# EAGLE design RX8Edaughter (EAGLE 6.6.0)

## Sheet 1 of 2
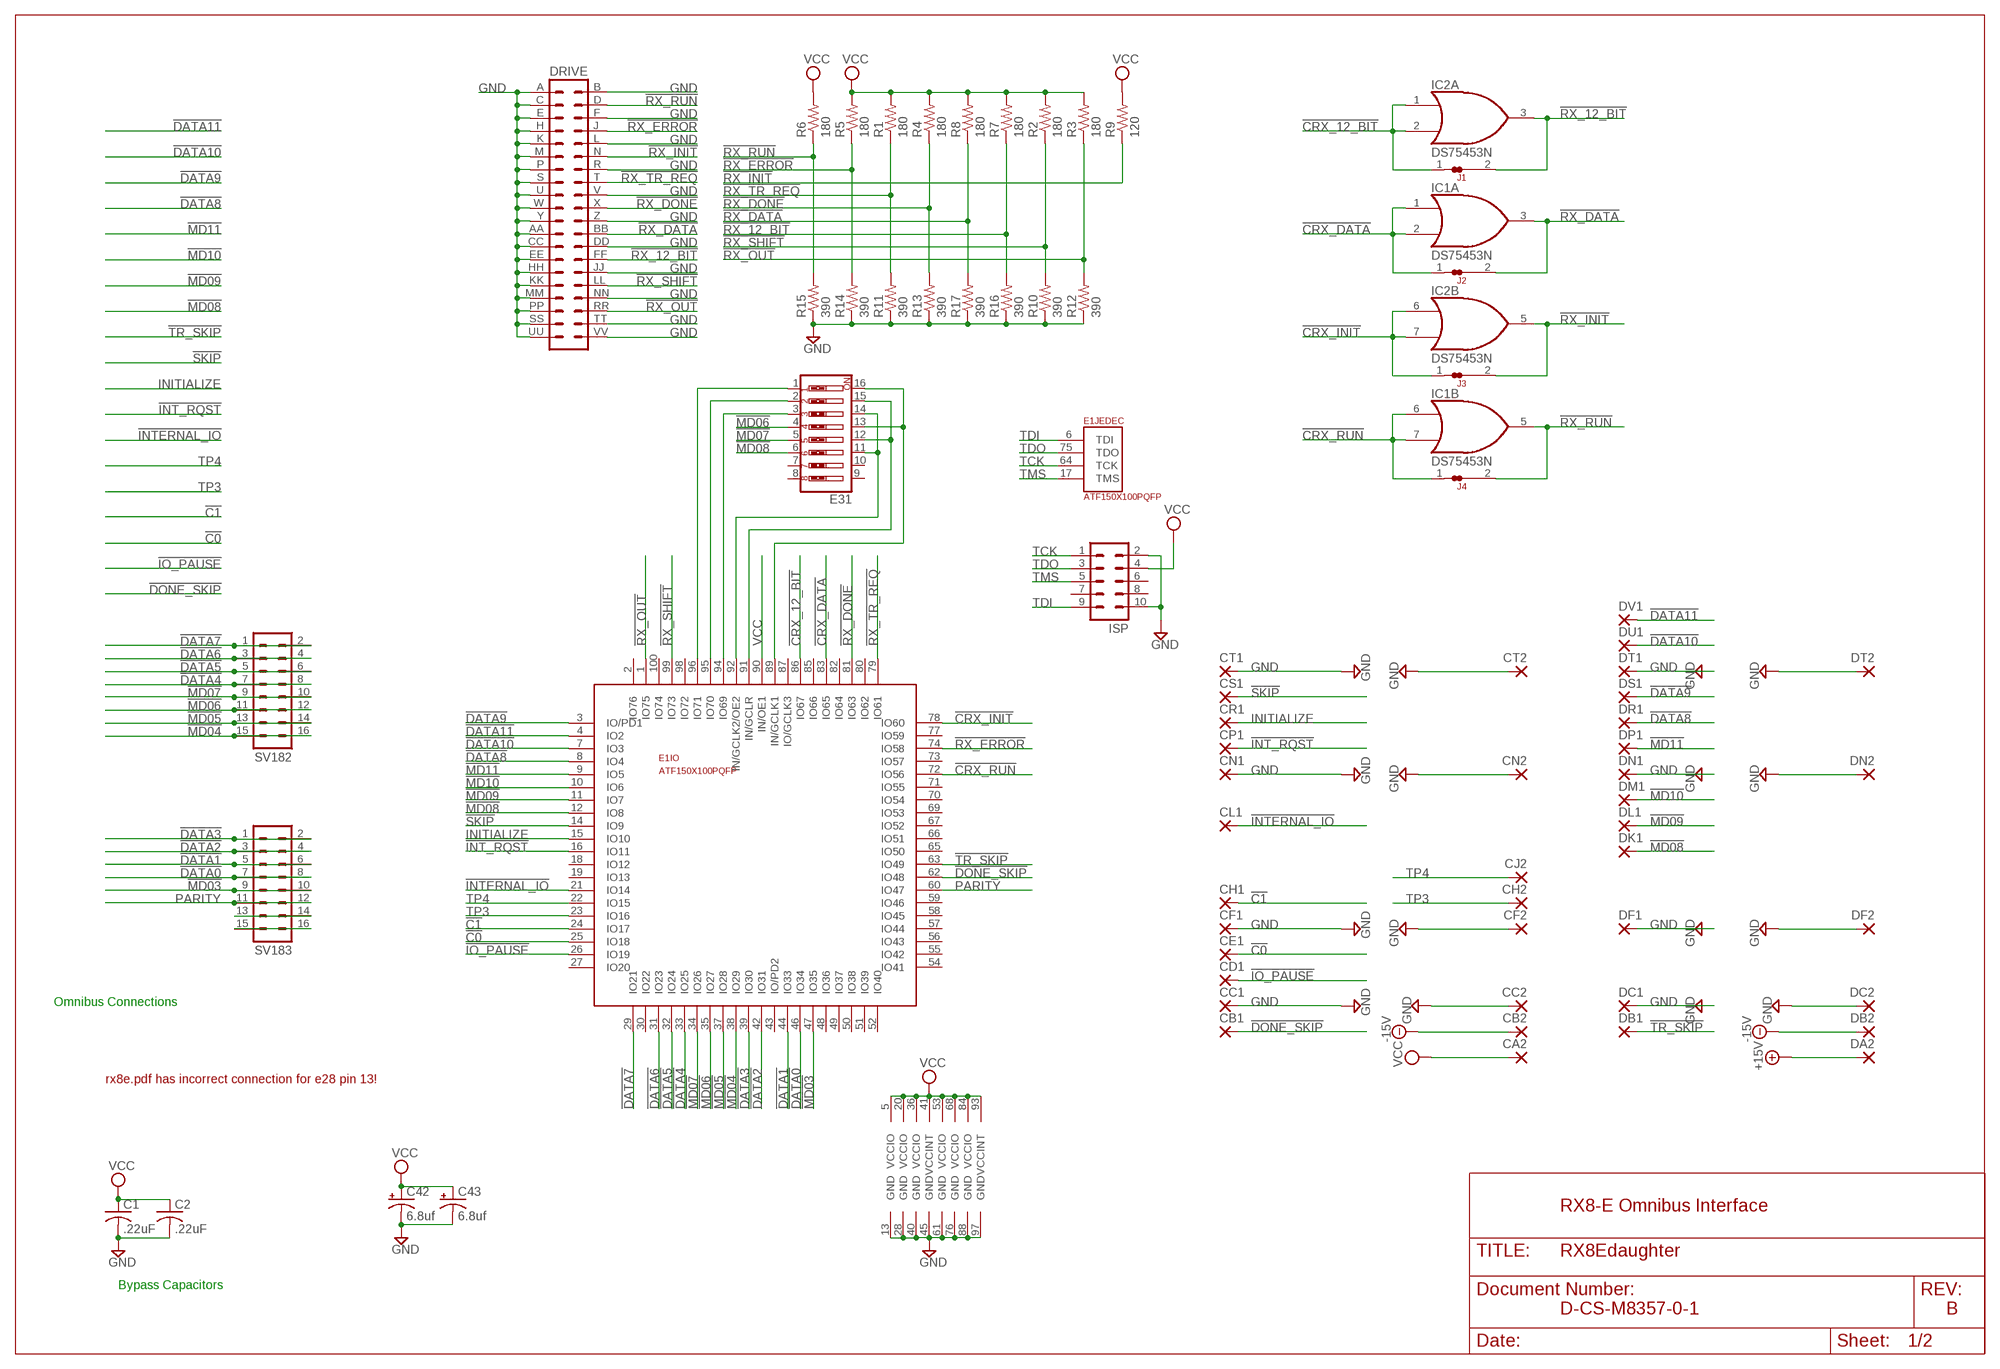
[diagram p0: schematic, sheet 1]

### Parts
C1  .22uF  C-US050-025X075  [C050-025X075]
C2  .22uF  C-US050-025X075  [C050-025X075]
C42  6.8uf  CPOL-USE22-6AXIAL  [E22-6]
C43  6.8uf  CPOL-USE22-6AXIAL  [E22-6]
CA2  1,6/0,9  [1,6/0,9]
CB1  1,6/0,9  [1,6/0,9]
CB2  1,6/0,9  [1,6/0,9]
CC1  1,6/0,9  [1,6/0,9]
CC2  1,6/0,9  [1,6/0,9]
CD1  1,6/0,9  [1,6/0,9]
CE1  1,6/0,9  [1,6/0,9]
CF1  1,6/0,9  [1,6/0,9]
CF2  1,6/0,9  [1,6/0,9]
CH1  1,6/0,9  [1,6/0,9]
CH2  1,6/0,9  [1,6/0,9]
CJ2  1,6/0,9  [1,6/0,9]
CL1  1,6/0,9  [1,6/0,9]
CN1  1,6/0,9  [1,6/0,9]
CN2  1,6/0,9  [1,6/0,9]
CP1  1,6/0,9  [1,6/0,9]
CR1  1,6/0,9  [1,6/0,9]
CS1  1,6/0,9  [1,6/0,9]
CT1  1,6/0,9  [1,6/0,9]
CT2  1,6/0,9  [1,6/0,9]
DA2  1,6/0,9  [1,6/0,9]
DB1  1,6/0,9  [1,6/0,9]
DB2  1,6/0,9  [1,6/0,9]
DC1  1,6/0,9  [1,6/0,9]
DC2  1,6/0,9  [1,6/0,9]
DF1  1,6/0,9  [1,6/0,9]
DF2  1,6/0,9  [1,6/0,9]
DK1  1,6/0,9  [1,6/0,9]
DL1  1,6/0,9  [1,6/0,9]
DM1  1,6/0,9  [1,6/0,9]
DN1  1,6/0,9  [1,6/0,9]
DN2  1,6/0,9  [1,6/0,9]
DP1  1,6/0,9  [1,6/0,9]
DR1  1,6/0,9  [1,6/0,9]
DRIVE  DEC40PINH  [DEC40PINH]
DS1  1,6/0,9  [1,6/0,9]
DT1  1,6/0,9  [1,6/0,9]
DT2  1,6/0,9  [1,6/0,9]
DU1  1,6/0,9  [1,6/0,9]
DV1  1,6/0,9  [1,6/0,9]
E1  ATF150X100PQFP  [PQFP-100]
E31  SW_DIP-8  [EDG-08]
IC1  DS75453N  [DIL08]
IC2  DS75453N  [DIL08]
ISP  ML10  [ML10]
J1  JUMPER-NC2  [NC2]
J2  JUMPER-NC2  [NC2]
J3  JUMPER-NC2  [NC2]
J4  JUMPER-NC2  [NC2]
R1  180  R-US_0207/10  [0207/10]
R2  180  R-US_0207/10  [0207/10]
R3  180  R-US_0207/10  [0207/10]
R4  180  R-US_0207/10  [0207/10]
R5  180  R-US_0207/10  [0207/10]
R6  180  R-US_0207/10  [0207/10]
R7  180  R-US_0207/10  [0207/10]
R8  180  R-US_0207/10  [0207/10]
R9  120  R-US_0207/10  [0207/10]
R10  390  R-US_0207/10  [0207/10]
R11  390  R-US_0207/10  [0207/10]
R12  390  R-US_0207/10  [0207/10]
R13  390  R-US_0207/10  [0207/10]
R14  390  R-US_0207/10  [0207/10]
R15  390  R-US_0207/10  [0207/10]
R16  390  R-US_0207/10  [0207/10]
R17  390  R-US_0207/10  [0207/10]
SV182  MA08-2  [MA08-2]
SV183  MA08-2  [MA08-2]

### Nets
!C0: CE1.1(P) E1.25(IO:IO18)
!C1: CH1.1(P) E1.24(IO:IO17)
!CRX_12_BIT: E1.86(IO:IO67) IC2.1(A:I0) IC2.2(A:I1) J1.1
!CRX_DATA: E1.83(IO:IO65) IC1.1(A:I0) IC1.2(A:I1) J2.1
!CRX_INIT: E1.78(IO:IO60) IC2.6(B:I0) IC2.7(B:I1) J3.1
!CRX_RUN: E1.72(IO:IO56) IC1.6(B:I0) IC1.7(B:I1) J4.1
!DATA0: E1.46(IO:IO34) SV183.7 SV183.8
!DATA1: E1.44(IO:IO33) SV183.5 SV183.6
!DATA2: E1.42(IO:IO31) SV183.3 SV183.4
!DATA3: E1.39(IO:IO30) SV183.1 SV183.2
!DATA4: E1.33(IO:IO25) SV182.7 SV182.8
!DATA5: E1.32(IO:IO24) SV182.5 SV182.6
!DATA6: E1.31(IO:IO23) SV182.3 SV182.4
!DATA7: E1.29(IO:IO21) SV182.1 SV182.2
!DATA8: DR1.1(P) E1.8(IO:IO4)
!DATA9: DS1.1(P) E1.3(IO:IO/PD1)
!DATA10: DU1.1(P) E1.7(IO:IO3)
!DATA11: DV1.1(P) E1.4(IO:IO2)
!DONE_SKIP: CB1.1(P) E1.62(IO:IO48)
!INT_RQST: CP1.1(P) E1.16(IO:IO11)
!INTERNAL_IO: CL1.1(P) E1.21(IO:IO14)
!IO_PAUSE: CD1.1(P) E1.26(IO:IO19)
!MD03: E1.47(IO:IO35) SV183.9 SV183.10
!MD04: E1.38(IO:IO29) SV182.15 SV182.16
!MD05: E1.37(IO:IO28) SV182.13 SV182.14
!MD06: E1.35(IO:IO27) E31.4 SV182.11 SV182.12
!MD07: E1.34(IO:IO26) E31.5 SV182.9 SV182.10
!MD08: DK1.1(P) E1.12(IO:IO8) E31.6
!MD09: DL1.1(P) E1.11(IO:IO7)
!MD10: DM1.1(P) E1.10(IO:IO6)
!MD11: DP1.1(P) E1.9(IO:IO5)
!RX_12_BIT: DRIVE.FF IC2.3(A:O) J1.2 R7.1 R16.2
!RX_DATA: DRIVE.BB IC1.3(A:O) J2.2 R8.1 R17.2
!RX_DONE: DRIVE.X E1.81(IO:IO63) R4.1 R13.2
!RX_ERROR: DRIVE.J E1.74(IO:IO58) R5.1 R14.2
!RX_INIT: DRIVE.N IC2.5(B:O) J3.2 R9.1
!RX_OUT: DRIVE.RR E1.1(IO:IO75) R3.1 R12.2
!RX_RUN: DRIVE.D IC1.5(B:O) J4.2 R6.1 R15.2
!RX_SHIFT: DRIVE.LL E1.99(IO:IO73) R2.1 R10.2
!RX_TR_REQ: DRIVE.T E1.79(IO:IO61) R1.1 R11.2
!SKIP: CS1.1(P) E1.14(IO:IO9)
!TR_SKIP: DB1.1(P) E1.63(IO:IO49)
+15V: DA2.1(P)
-15V [supply]: CB2.1(P) DB2.1(P)
GND [supply]: C1.2 C2.2 C42.- C43.- CC1.1(P) CC2.1(P) CF1.1(P) CF2.1(P) CN1.1(P) CN2.1(P) CT1.1(P) CT2.1(P) DC1.1(P) DC2.1(P) DF1.1(P) DF2.1(P) DN1.1(P) DN2.1(P) DRIVE.A DRIVE.AA DRIVE.B DRIVE.C DRIVE.CC DRIVE.DD DRIVE.E DRIVE.EE DRIVE.F DRIVE.H DRIVE.HH DRIVE.JJ DRIVE.K DRIVE.KK DRIVE.L DRIVE.M DRIVE.MM DRIVE.NN DRIVE.P DRIVE.PP DRIVE.R DRIVE.S DRIVE.SS DRIVE.TT DRIVE.U DRIVE.UU DRIVE.V DRIVE.VV DRIVE.W DRIVE.Y DRIVE.Z DT1.1(P) DT2.1(P) E1.13(GND) E1.28(GND) E1.40(GND) E1.45(GND) E1.61(GND) E1.76(GND) E1.88(GND) E1.97(GND) ISP.2 ISP.10 R10.1 R11.1 R12.1 R13.1 R14.1 R15.1 R16.1 R17.1 ; also sheet 2
INITIALIZE: CR1.1(P) E1.15(IO:IO10)
N$1: E1.94(IO:IO69) E31.3
N$18: E1.95(IO:IO70) E31.2
N$19: E1.96(IO:IO71) E31.1
N$20: E1.92(IO:IN/GCLK2/OE2) E31.11 E31.14
N$37: E1.91(IO:IN/GCLR) E31.12 E31.15
N$38: E1.89(IO:IN/GCLK1) E31.13 E31.16
N$45: SV183.13 SV183.14
N$828: SV183.15 SV183.16
PARITY: E1.60(IO:IO47) SV183.11 SV183.12
TCK: E1.64(JEDEC:TCK) ISP.1
TDI: E1.6(JEDEC:TDI) ISP.9
TDO: E1.75(JEDEC:TDO) ISP.3
TMS: E1.17(JEDEC:TMS) ISP.5
TP3: CH2.1(P) E1.23(IO:IO16)
TP4: CJ2.1(P) E1.22(IO:IO15)
VCC [supply]: C1.1 C2.1 C42.+ C43.+ CA2.1(P) E1.5(VCCIO) E1.20(VCCIO) E1.36(VCCIO) E1.41(VCCINT) E1.53(VCCIO) E1.68(VCCIO) E1.84(VCCIO) E1.90(IO:IN/OE1) E1.93(VCCINT) ISP.4 R1.2 R2.2 R3.2 R4.2 R5.2 R6.2 R7.2 R8.2 R9.2 ; also sheet 2
Unconnected: E1.2(IO:IO76) E1.18(IO:IO12) E1.19(IO:IO13) E1.27(IO:IO20) E1.30(IO:IO22) E1.43(IO:IO/PD2) E1.48(IO:IO36) E1.49(IO:IO37) E1.50(IO:IO38) E1.51(IO:IO39) E1.52(IO:IO40) E1.54(IO:IO41) E1.55(IO:IO42) E1.56(IO:IO43) E1.57(IO:IO44) E1.58(IO:IO45) E1.59(IO:IO46) E1.65(IO:IO50) E1.66(IO:IO51) E1.67(IO:IO52) E1.69(IO:IO53) E1.70(IO:IO54) E1.71(IO:IO55) E1.73(IO:IO57) E1.77(IO:IO59) E1.80(IO:IO62) E1.82(IO:IO64) E1.85(IO:IO66) E1.87(IO:IO/GCLK3) E1.98(IO:IO72) E1.100(IO:IO74) E31.7 E31.8 E31.9 E31.10 ISP.6 ISP.7 ISP.8

### Notes on the sheet
- Omnibus Connections
- rx8e.pdf has incorrect connection for e28 pin 13!
- RX8-E Omnibus Interface
- Bypass Capacitors
- D-CS-M8357-0-1 | B

## Sheet 2 of 2
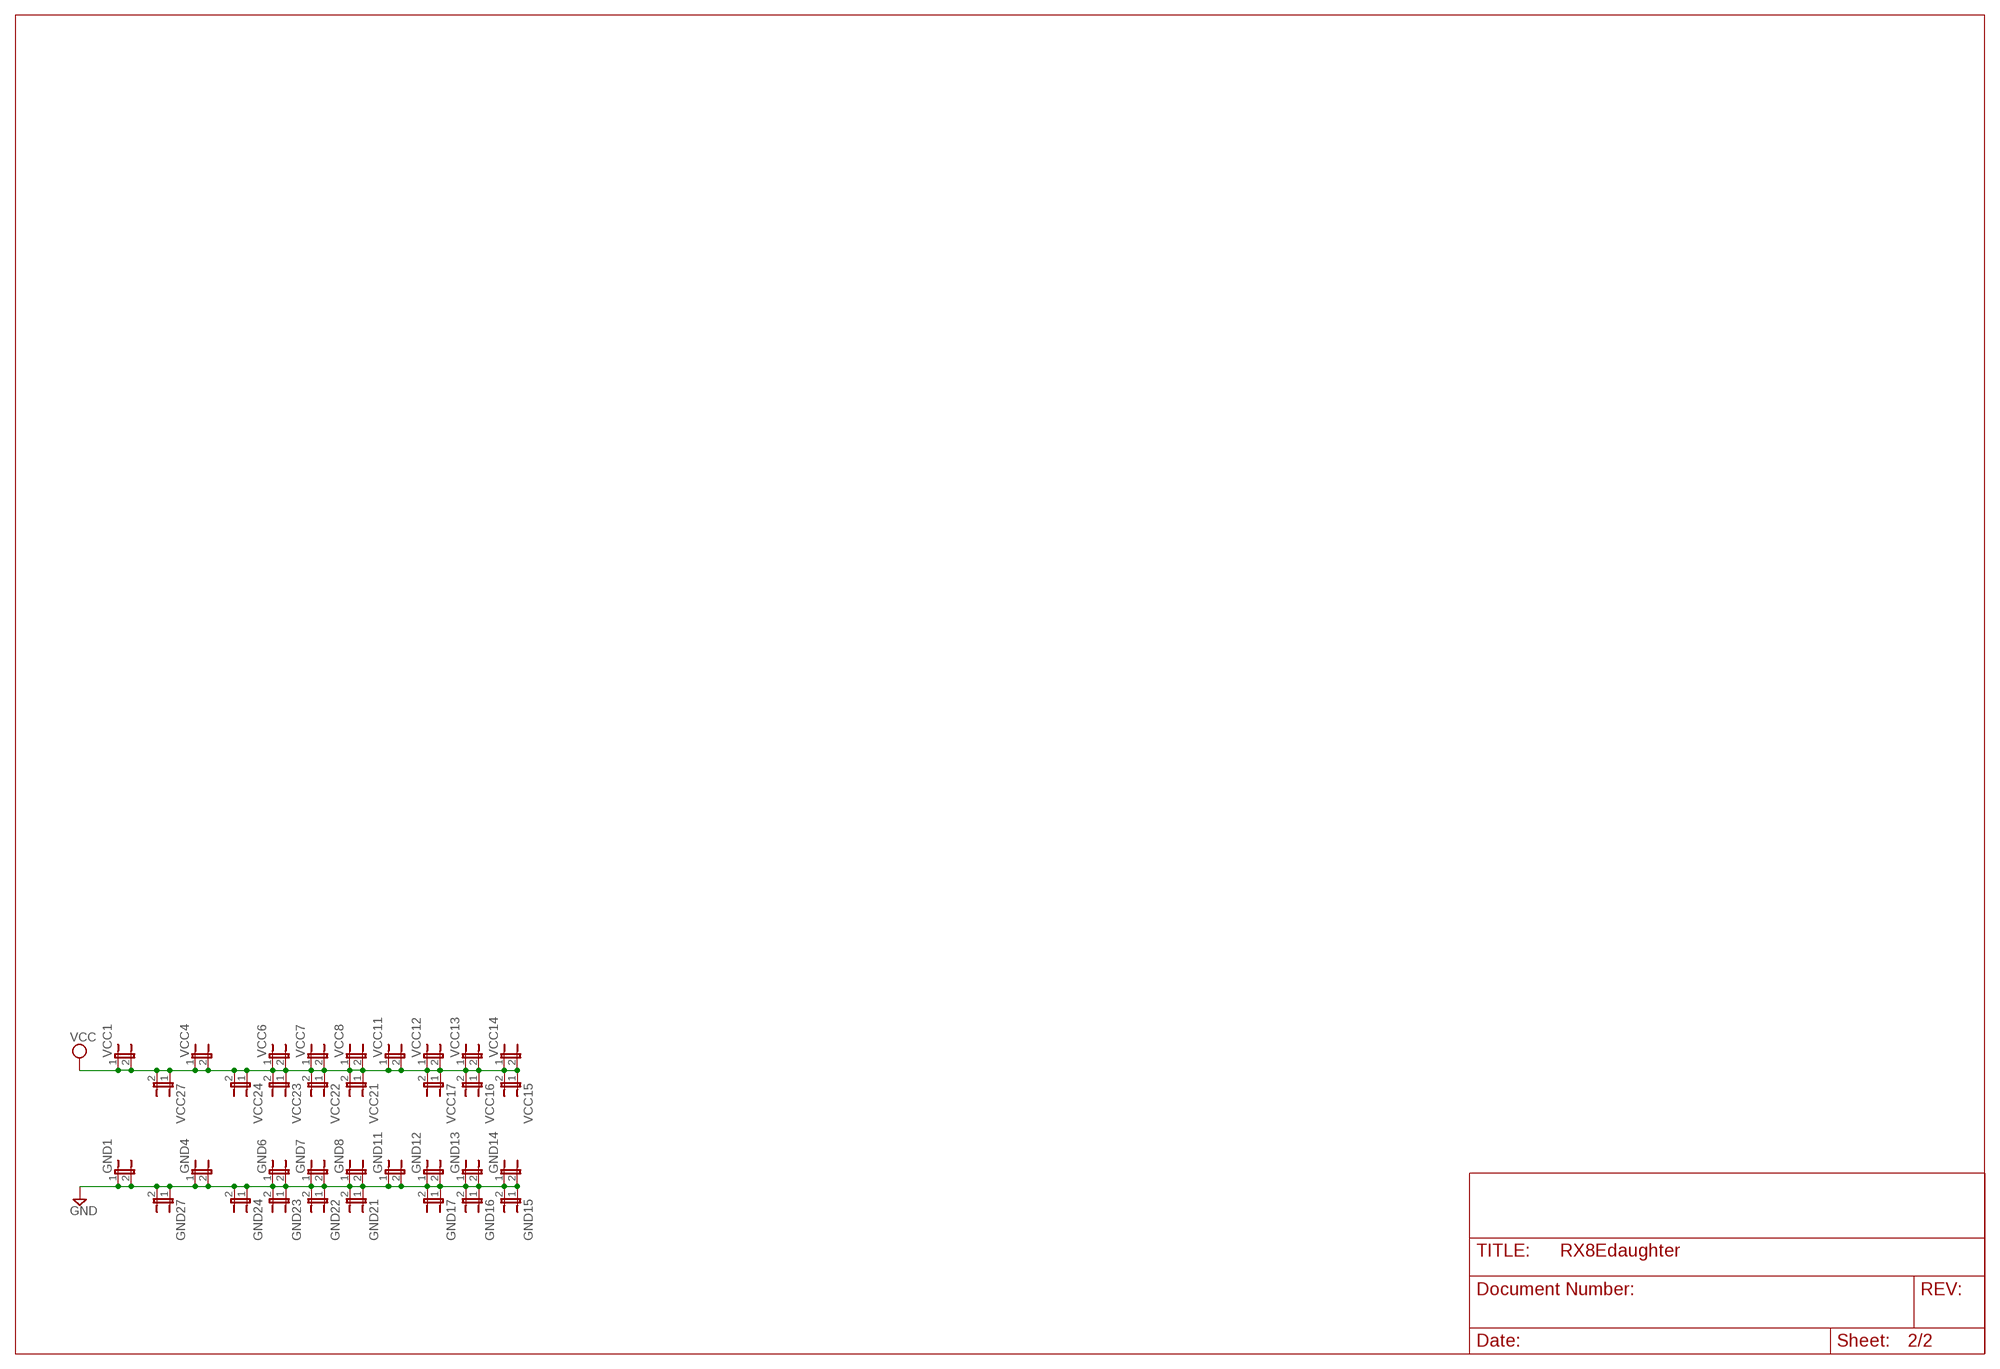
[diagram p1: schematic, sheet 2]

### Parts
GND1  JP1E  [JP1]
GND4  JP1E  [JP1]
GND6  JP1E  [JP1]
GND7  JP1E  [JP1]
GND8  JP1E  [JP1]
GND11  JP1E  [JP1]
GND12  JP1E  [JP1]
GND13  JP1E  [JP1]
GND14  JP1E  [JP1]
GND15  JP1E  [JP1]
GND16  JP1E  [JP1]
GND17  JP1E  [JP1]
GND21  JP1E  [JP1]
GND22  JP1E  [JP1]
GND23  JP1E  [JP1]
GND24  JP1E  [JP1]
GND27  JP1E  [JP1]
VCC1  JP1E  [JP1]
VCC4  JP1E  [JP1]
VCC6  JP1E  [JP1]
VCC7  JP1E  [JP1]
VCC8  JP1E  [JP1]
VCC11  JP1E  [JP1]
VCC12  JP1E  [JP1]
VCC13  JP1E  [JP1]
VCC14  JP1E  [JP1]
VCC15  JP1E  [JP1]
VCC16  JP1E  [JP1]
VCC17  JP1E  [JP1]
VCC21  JP1E  [JP1]
VCC22  JP1E  [JP1]
VCC23  JP1E  [JP1]
VCC24  JP1E  [JP1]
VCC27  JP1E  [JP1]

### Nets
GND [supply]: GND1.1 GND1.2 GND4.1 GND4.2 GND6.1 GND6.2 GND7.1 GND7.2 GND8.1 GND8.2 GND11.1 GND11.2 GND12.1 GND12.2 GND13.1 GND13.2 GND14.1 GND14.2 GND15.1 GND15.2 GND16.1 GND16.2 GND17.1 GND17.2 GND21.1 GND21.2 GND22.1 GND22.2 GND23.1 GND23.2 GND24.1 GND24.2 GND27.1 GND27.2 ; also sheet 1
VCC [supply]: VCC1.1 VCC1.2 VCC4.1 VCC4.2 VCC6.1 VCC6.2 VCC7.1 VCC7.2 VCC8.1 VCC8.2 VCC11.1 VCC11.2 VCC12.1 VCC12.2 VCC13.1 VCC13.2 VCC14.1 VCC14.2 VCC15.1 VCC15.2 VCC16.1 VCC16.2 VCC17.1 VCC17.2 VCC21.1 VCC21.2 VCC22.1 VCC22.2 VCC23.1 VCC23.2 VCC24.1 VCC24.2 VCC27.1 VCC27.2 ; also sheet 1

## Power pins joined to a net without a drawn wire
GND: IC1.4(P:GND) IC2.4(P:GND)
VCC: IC1.8(P:VCC) IC2.8(P:VCC)

## Library data of the parts
C1 C2 = rcl:C-US: CAPACITOR, American symbol
C42 C43 = rcl:CPOL-US: POLARIZED CAPACITOR, American symbol
CA2 CB1 CB2 CC1 CC2 CD1 CE1 CF1 CF2 CH1 CH2 CJ2 CL1 CN1 CN2 CP1 CR1 CS1 CT1 CT2 DA2 DB1 DB2 DC1 DC2 DF1 DF2 DK1 DL1 DM1 DN1 DN2 DP1 DR1 DS1 DT1 DT2 DU1 DV1 = wirepad:1,6/0,9: THROUGH-HOLE PAD
DRIVE = dec-con:DEC40PIN: PIN HEADER
E1 = atmel-cpld:ATF150X100: ATF150x in 100 pin package.
E31 = special:SW_DIP-8: DIP SWITCH
GND1 GND4 GND6-GND8 GND11-GND17 GND21-GND24 GND27 VCC1 VCC4 VCC6-VCC8 VCC11-VCC17 VCC21-VCC24 VCC27 = jumper:JP1E: JUMPER
IC1 IC2 = dec-con:DS75453: Quad 2-input OR gate, open collector output
ISP = con-harting-ml:ML10: HARTING; OC_FARNELL: unknown; OC_NEWARK: unknown
J1-J4 = dec-con:JUMPER: Normally closed SMD Jumper (Generates a DRC error.)
R1-R17 = rcl:R-US_: RESISTOR, American symbol
SV182 SV183 = con-lstb:MA08-2: PIN HEADER; OC_FARNELL: unknown; OC_NEWARK: unknown

## Board
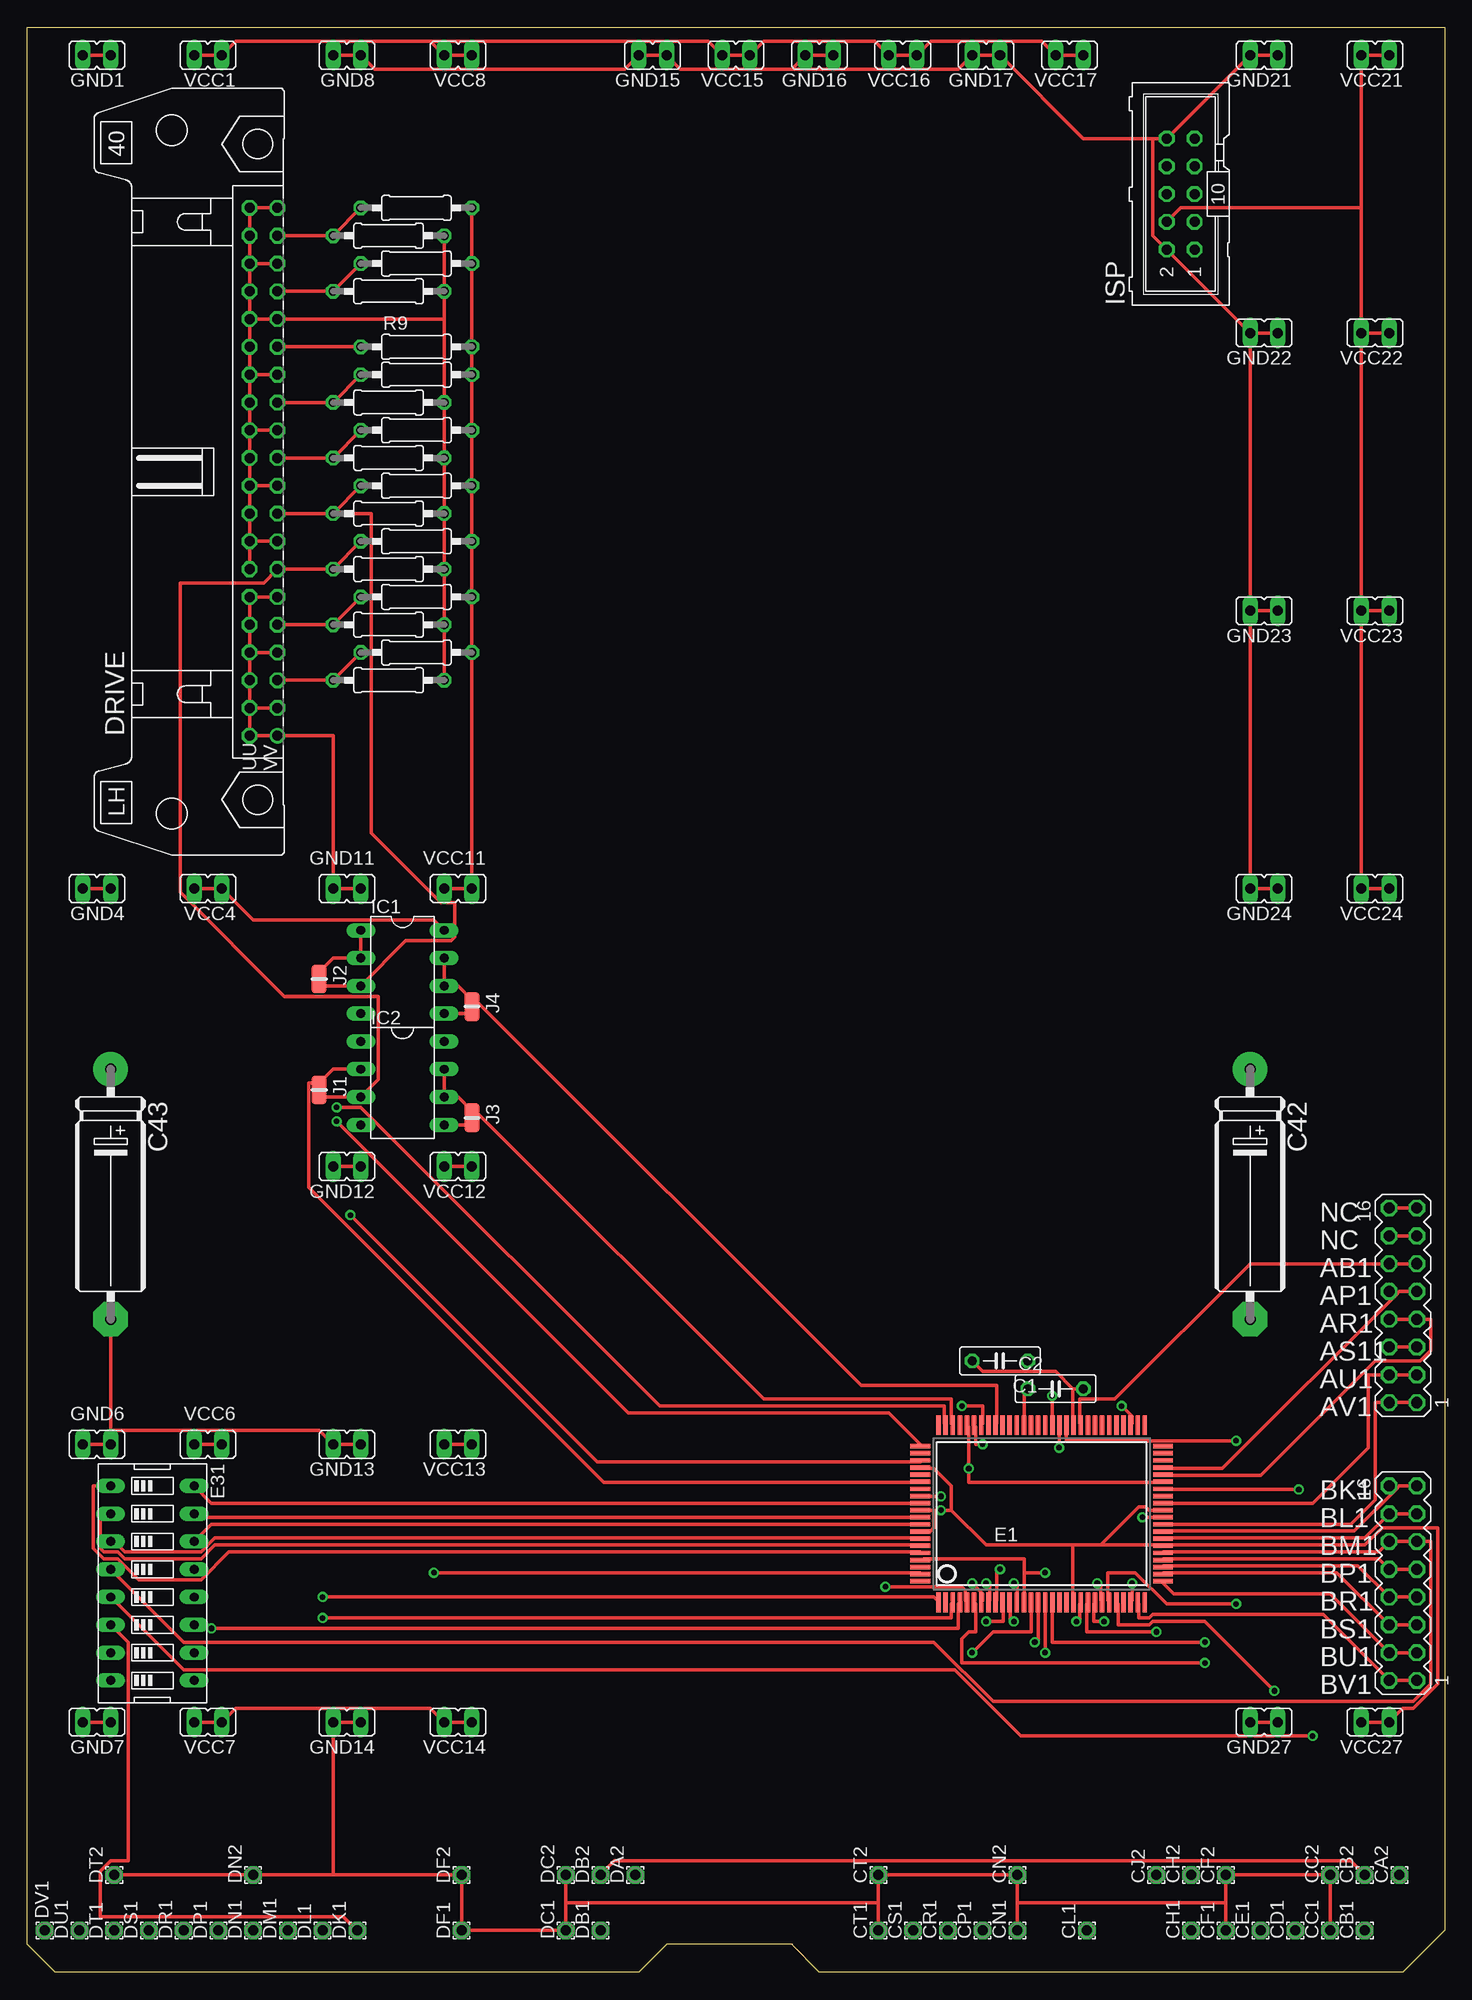
[diagram p2: board, top side]
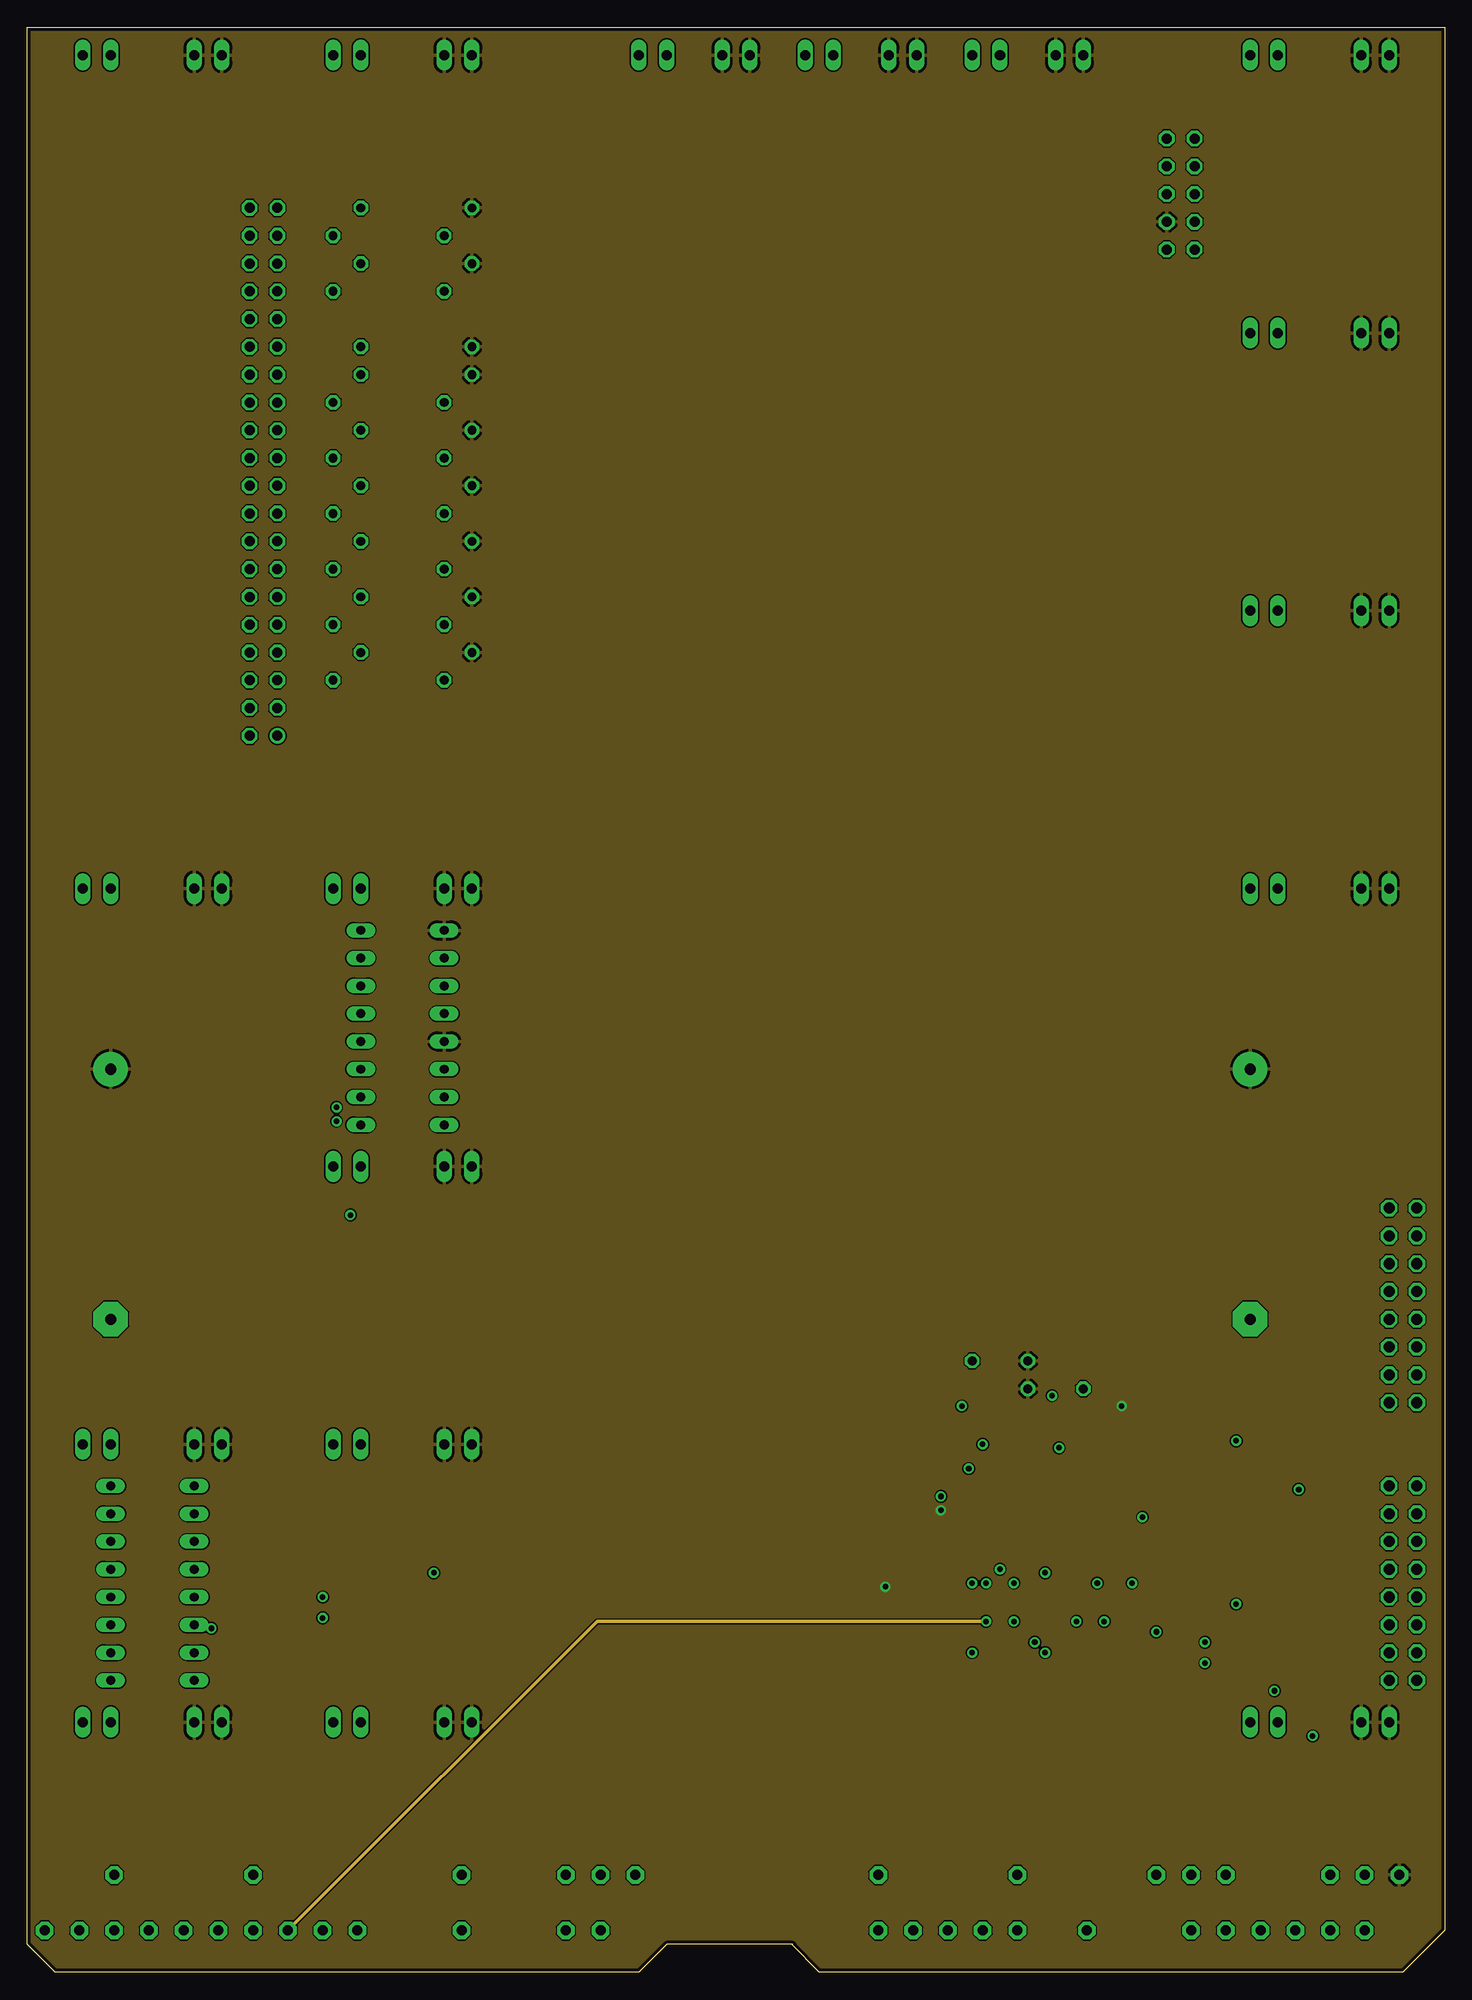
[diagram p3: board, inner layer VCC$]
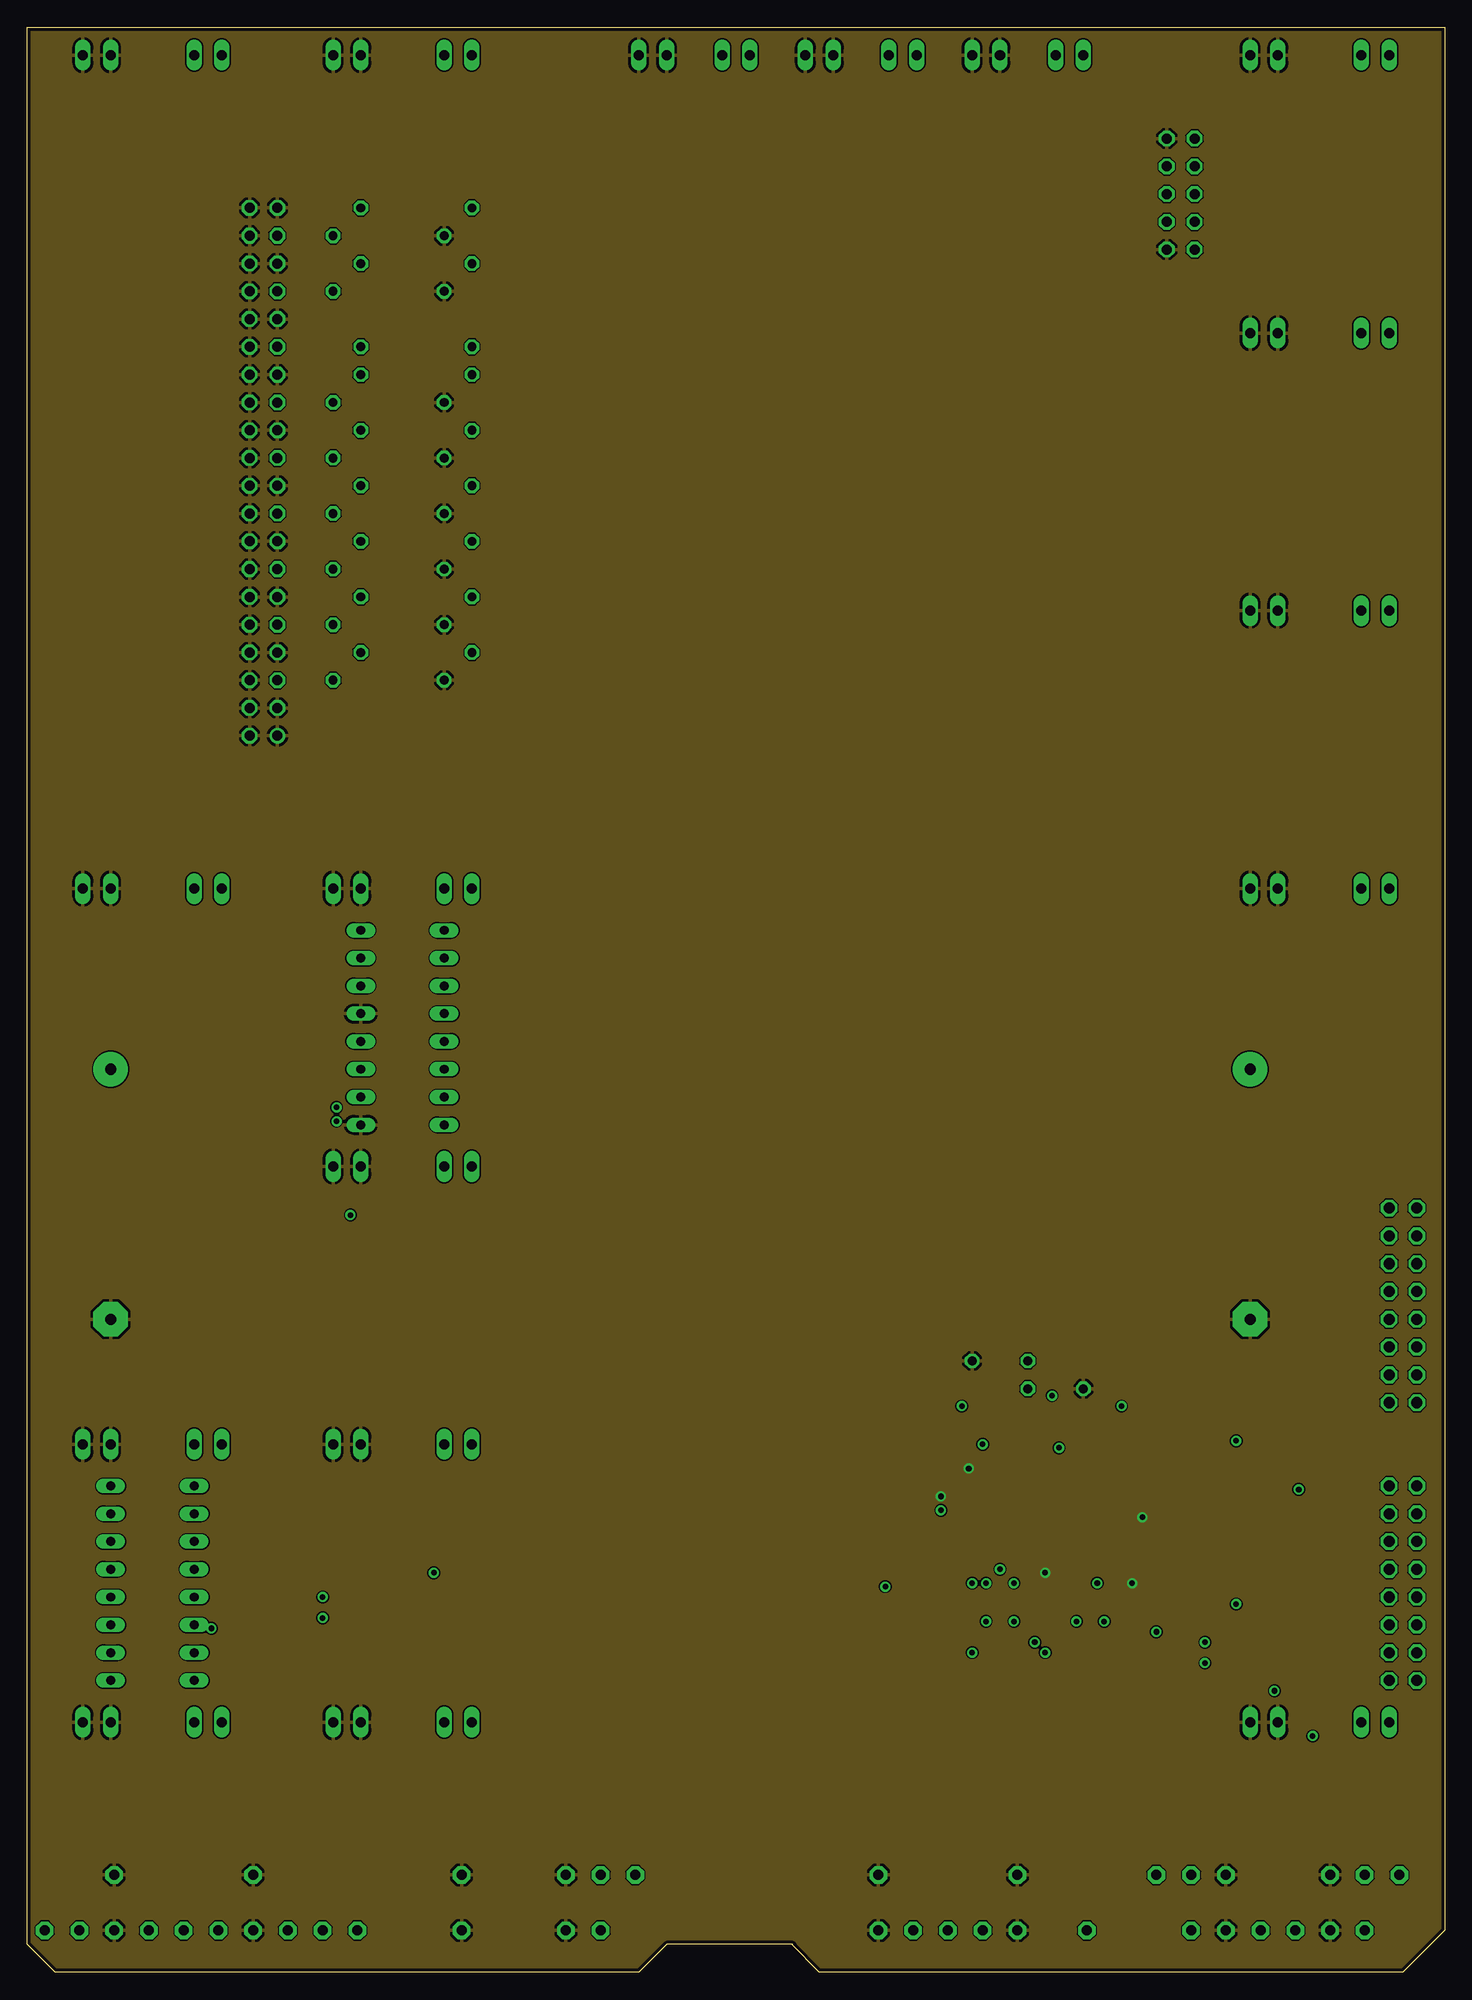
[diagram p4: board, inner layer GND$]
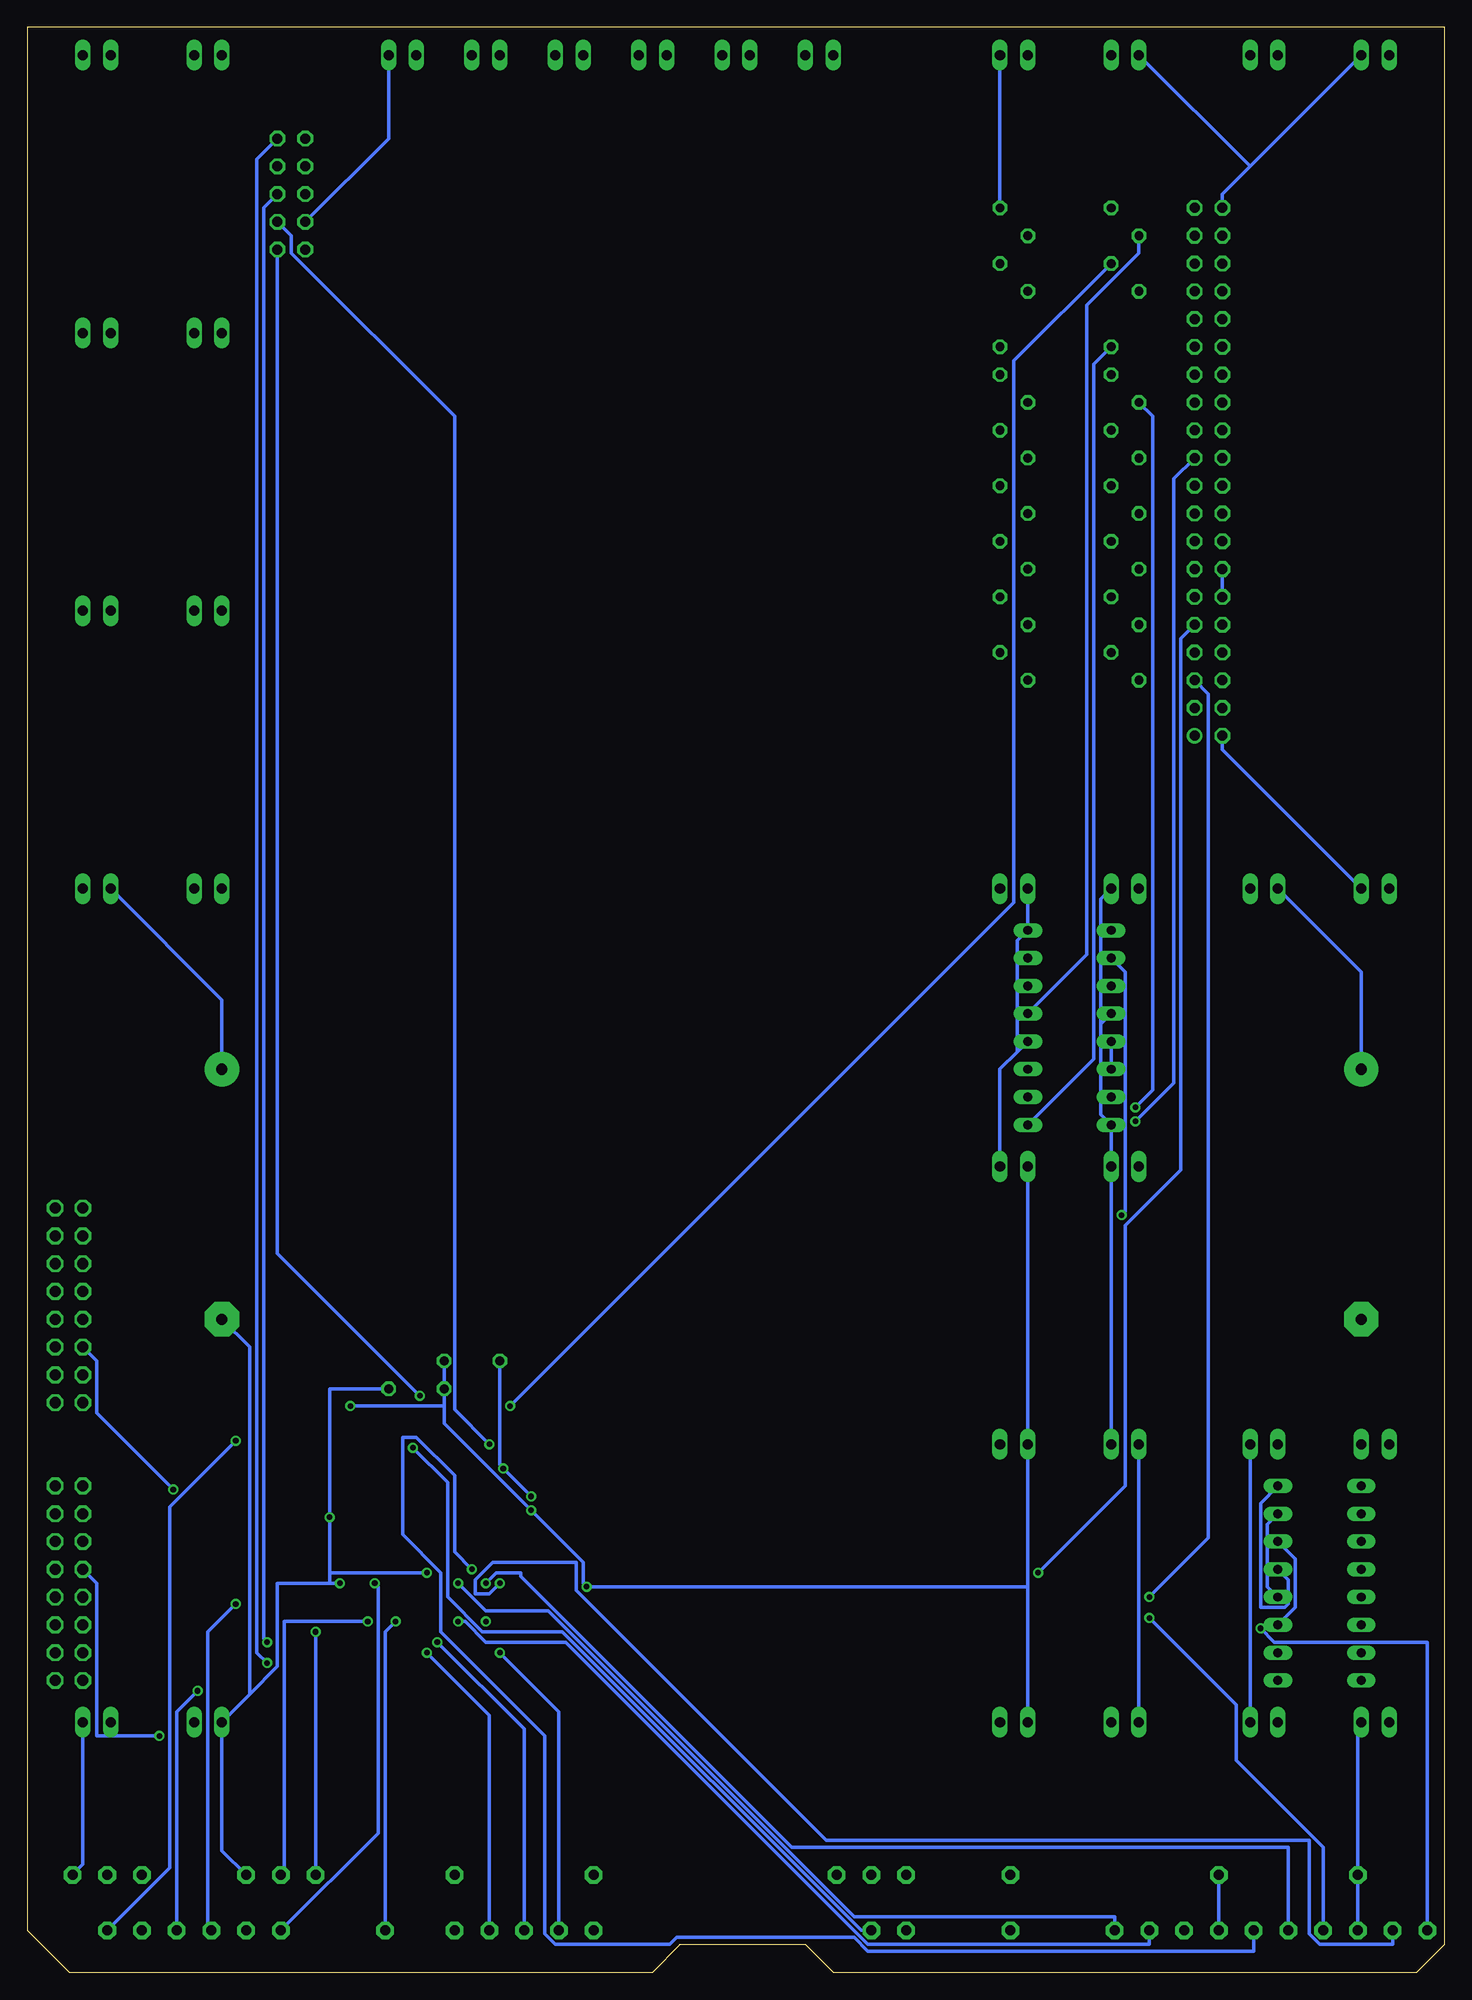
[diagram p5: board, bottom side, seen from below]

Size 129.54 x 177.8 mm. Coordinates in mm from the lower left corner, seen from the top.
Outline: 69.98,2.54 69.85,2.54
Outline: 69.85,2.54 72.39,0 125.73,0 129.54,3.81 129.54,177.8 0,177.8 0,2.54 2.54,0 55.88,0 58.42,2.54 69.85,2.54
Copper layers (1+2+3+16): Top 0.035mm / dielectric 1.5mm / VCC$ 0.035mm / dielectric 0.15mm / GND$ 0.035mm / dielectric 0.2mm / Bottom 0.035mm
Design rules "pld *": minimum track width 12mil, minimum drill 20mil, track to track 5mil, track to pad 5mil, pad to pad 5mil, via to via 10mil, smd to smd 5mil, copper to edge 13mil, drill to drill 10mil, minimum pad ring 10mil, minimum via ring 8mil, stop-mask expansion 0mil, vias tented up to drill 0mil, thermal gap 10mil

### Footprints (pad centres in the part's own frame; a part is rotated, then mirrored left to right if it is on the bottom)
C050-025X075 = drill 0.813 octagon: 1 -2.54,0; 2 2.54,0
E22-6 = drill 1.016 pad 3.15: + -11.43,0 | drill 1.016 pad 3.15 octagon: - 11.43,0
1,6/0,9 = drill 0.914 pad 1.6 octagon: 1 0,0
DEC40PINH = drill 0.914 octagon: A 24.13,1.27; AA -3.81,1.27; B 24.13,-1.27; BB -3.81,-1.27; C 21.59,1.27; CC -6.35,1.27; D 21.59,-1.27; DD -6.35,-1.27; E 19.05,1.27; EE -8.89,1.27; F 19.05,-1.27; FF -8.89,-1.27; H 16.51,1.27; HH -11.43,1.27; J 16.51,-1.27; JJ -11.43,-1.27; K 13.97,1.27; KK -13.97,1.27; L 13.97,-1.27; LL -13.97,-1.27; M 11.43,1.27; MM -16.51,1.27; N 11.43,-1.27; NN -16.51,-1.27; P 8.89,1.27; PP -19.05,1.27; R 8.89,-1.27; RR -19.05,-1.27; S 6.35,1.27; SS -21.59,1.27; T 6.35,-1.27; TT -21.59,-1.27; U 3.81,1.27; UU -24.13,1.27; V 3.81,-1.27; W 1.27,1.27; X 1.27,-1.27; Y -1.27,1.27; Z -1.27,-1.27 | drill 0.914: VV -24.13,-1.27
PQFP-100 = smd 0.4 x 1.8: 1 -9.425,-8.1; 2 -8.775,-8.1; 3 -8.125,-8.1; 4 -7.475,-8.1; 5 -6.825,-8.1; 6 -6.175,-8.1; 7 -5.525,-8.1; 8 -4.875,-8.1; 9 -4.225,-8.1; 10 -3.575,-8.1; 11 -2.925,-8.1; 12 -2.275,-8.1; 13 -1.625,-8.1; 14 -0.975,-8.1; 15 -0.325,-8.1; 16 0.325,-8.1; 17 0.975,-8.1; 18 1.625,-8.1; 19 2.275,-8.1; 20 2.925,-8.1; 21 3.575,-8.1; 22 4.225,-8.1; 23 4.875,-8.1; 24 5.525,-8.1; 25 6.175,-8.1; 26 6.825,-8.1; 27 7.475,-8.1; 28 8.125,-8.1; 29 8.775,-8.1; 30 9.425,-8.1; 51 9.425,8.1; 52 8.775,8.1; 53 8.125,8.1; 54 7.475,8.1; 55 6.825,8.1; 56 6.175,8.1; 57 5.525,8.1; 58 4.875,8.1; 59 4.225,8.1; 60 3.575,8.1; 61 2.925,8.1; 62 2.275,8.1; 63 1.625,8.1; 64 0.975,8.1; 65 0.325,8.1; 66 -0.325,8.1; 67 -0.975,8.1; 68 -1.625,8.1; 69 -2.275,8.1; 70 -2.925,8.1; 71 -3.575,8.1; 72 -4.225,8.1; 73 -4.875,8.1; 74 -5.525,8.1; 75 -6.175,8.1; 76 -6.825,8.1; 77 -7.475,8.1; 78 -8.125,8.1; 79 -8.775,8.1; 80 -9.425,8.1 | smd 1.8 x 0.4: 31 11.1,-6.175; 32 11.1,-5.525; 33 11.1,-4.875; 34 11.1,-4.225; 35 11.1,-3.575; 36 11.1,-2.925; 37 11.1,-2.275; 38 11.1,-1.625; 39 11.1,-0.975; 40 11.1,-0.325; 41 11.1,0.325; 42 11.1,0.975; 43 11.1,1.625; 44 11.1,2.275; 45 11.1,2.925; 46 11.1,3.575; 47 11.1,4.225; 48 11.1,4.875; 49 11.1,5.525; 50 11.1,6.175; 81 -11.1,6.175; 82 -11.1,5.525; 83 -11.1,4.875; 84 -11.1,4.225; 85 -11.1,3.575; 86 -11.1,2.925; 87 -11.1,2.275; 88 -11.1,1.625; 89 -11.1,0.975; 90 -11.1,0.325; 91 -11.1,-0.325; 92 -11.1,-0.975; 93 -11.1,-1.625; 94 -11.1,-2.275; 95 -11.1,-2.925; 96 -11.1,-3.575; 97 -11.1,-4.225; 98 -11.1,-4.875; 99 -11.1,-5.525; 100 -11.1,-6.175
EDG-08 = drill 0.813 long: 1 -8.89,-3.81; 2 -6.35,-3.81; 3 -3.81,-3.81; 4 -1.27,-3.81; 5 1.27,-3.81; 6 3.81,-3.81; 7 6.35,-3.81; 8 8.89,-3.81; 9 8.89,3.81; 10 6.35,3.81; 11 3.81,3.81; 12 1.27,3.81; 13 -1.27,3.81; 14 -3.81,3.81; 15 -6.35,3.81; 16 -8.89,3.81
JP1 = drill 0.914 long: 1 0,-1.27; 2 0,1.27
DIL08 = drill 0.813 long: 1 -3.81,-3.81; 2 -1.27,-3.81; 3 1.27,-3.81; 4 3.81,-3.81; 5 3.81,3.81; 6 1.27,3.81; 7 -1.27,3.81; 8 -3.81,3.81
ML10 = drill 0.914 octagon: 1 -5.08,-1.27; 2 -5.08,1.27; 3 -2.54,-1.27; 4 -2.54,1.27; 5 0,-1.27; 6 0,1.27; 7 2.54,-1.27; 8 2.54,1.27; 9 5.08,-1.27; 10 5.08,1.27
NC2 = smd 1.346 x 1.346: 1 -0.635,0; 2 0.635,0
0207/10 = drill 0.813 octagon: 1 -5.08,0; 2 5.08,0
MA08-2 = drill 1.016 octagon: 1 -8.89,-1.27; 2 -8.89,1.27; 3 -6.35,-1.27; 4 -6.35,1.27; 5 -3.81,-1.27; 6 -3.81,1.27; 7 -1.27,-1.27; 8 -1.27,1.27; 9 1.27,-1.27; 10 1.27,1.27; 11 3.81,-1.27; 12 3.81,1.27; 13 6.35,-1.27; 14 6.35,1.27; 15 8.89,-1.27; 16 8.89,1.27

### Placement (x,y rotation side)
C1  88.9,55.88 180 top
C2  93.98,53.34 0 top
C42  111.76,71.12 270 top
C43  7.62,71.12 270 top
CA2  125.41,8.89 90 top
CB1  122.24,3.81 90 top
CB2  122.24,8.89 90 top
CC1  119.06,3.81 90 top
CC2  119.06,8.89 90 top
CD1  115.89,3.81 90 top
CE1  112.71,3.81 90 top
CF1  109.54,3.81 90 top
CF2  109.54,8.89 90 top
CH1  106.36,3.81 90 top
CH2  106.36,8.89 90 top
CJ2  103.19,8.89 90 top
CL1  96.84,3.81 90 top
CN1  90.49,3.81 90 top
CN2  90.49,8.89 90 top
CP1  87.31,3.81 90 top
CR1  84.14,3.81 90 top
CS1  80.96,3.81 90 top
CT1  77.79,3.81 90 top
CT2  77.79,8.89 90 top
DA2  55.56,8.89 90 top
DB1  52.39,3.81 90 top
DB2  52.39,8.89 90 top
DC1  49.21,3.81 90 top
DC2  49.21,8.89 90 top
DF1  39.69,3.81 90 top
DF2  39.69,8.89 90 top
DK1  30.16,3.81 90 top
DL1  26.99,3.81 90 top
DM1  23.81,3.81 90 top
DN1  20.64,3.81 90 top
DN2  20.64,8.89 90 top
DP1  17.46,3.81 90 top
DR1  14.29,3.81 90 top
DRIVE  21.59,137.16 90 top
DS1  11.11,3.81 90 top
DT1  7.94,3.81 90 top
DT2  7.94,8.89 90 top
DU1  4.76,3.81 90 top
DV1  1.59,3.81 90 top
E1  92.71,41.91 0 top
E31  11.43,35.56 270 top
GND1  6.35,175.26 90 top
GND4  6.35,99.06 90 top
GND6  6.35,48.26 90 top
GND7  6.35,22.86 90 top
GND8  29.21,175.26 90 top
GND11  29.21,99.06 90 top
GND12  29.21,73.66 90 top
GND13  29.21,48.26 90 top
GND14  29.21,22.86 90 top
GND15  57.15,175.26 90 top
GND16  72.39,175.26 90 top
GND17  87.63,175.26 90 top
GND21  113.03,175.26 90 top
GND22  113.03,149.86 90 top
GND23  113.03,124.46 90 top
GND24  113.03,99.06 90 top
GND27  113.03,22.86 90 top
IC1  34.29,91.44 270 top
IC2  34.29,81.28 270 top
ISP  105.41,162.56 90 top
J1  26.67,80.64 270 top
J2  26.67,90.81 270 top
J3  40.64,78.11 270 top
J4  40.64,88.27 270 top
R1  35.56,146.05 0 top
R2  35.56,125.73 0 top
R3  35.56,120.65 0 top
R4  35.56,140.97 0 top
R5  35.56,156.21 0 top
R6  35.56,161.29 0 top
R7  35.56,130.81 0 top
R8  35.56,135.89 0 top
R9  35.56,148.59 0 top
R10  33.02,123.19 180 top
R11  33.02,143.51 180 top
R12  33.02,118.11 180 top
R13  33.02,138.43 180 top
R14  33.02,153.67 180 top
R15  33.02,158.75 180 top
R16  33.02,128.27 180 top
R17  33.02,133.35 180 top
SV182  125.73,35.56 90 top
SV183  125.73,60.96 90 top
VCC1  16.51,175.26 90 top
VCC4  16.51,99.06 90 top
VCC6  16.51,48.26 90 top
VCC7  16.51,22.86 90 top
VCC8  39.37,175.26 90 top
VCC11  39.37,99.06 90 top
VCC12  39.37,73.66 90 top
VCC13  39.37,48.26 90 top
VCC14  39.37,22.86 90 top
VCC15  64.77,175.26 90 top
VCC16  80.01,175.26 90 top
VCC17  95.25,175.26 90 top
VCC21  123.19,175.26 90 top
VCC22  123.19,149.86 90 top
VCC23  123.19,124.46 90 top
VCC24  123.19,99.06 90 top
VCC27  123.19,22.86 90 top

### Tracks (layer width: path | path; a pad name or v marks a point on that pad's centre or on a via)
!C0  (via drill 0.51)
  Top 0.305: v110.49,33.66 104.14,33.66 101.28,36.51 98.74,36.51 98.74,33.97 E1.25
  Bottom 0.305: v110.49,33.66 113.03,31.11 113.03,4.13 CE1.1
!C1  (via drill 0.51)
  Top 0.305: v97.79,35.56 98.11,35.56 98.11,33.97 E1.24
  Bottom 0.305: v97.79,35.56 97.47,35.24 97.47,12.7 CH1.1
!CRX_12_BIT
  Top 0.305: IC2.2 27.94,82.55 J1.1 25.72,81.28 25.72,71.75 52.7,44.77 81.6,44.77 E1.86
  Bottom 0.305: IC2.2 IC2.1
!CRX_DATA  (via drill 0.51)
  Top 0.305: J2.1 27.94,92.71 IC1.2 IC1.1 | v29.53,69.22 52.07,46.67 81.6,46.67 E1.83
  Bottom 0.305: v29.53,69.22 29.21,69.53 29.21,91.44 IC1.2
!CRX_INIT
  Top 0.305: E1.78 84.45,50.16 84.45,52.39 67.31,52.39 40.96,78.74 J3.1 39.37,80.01 IC2.6 IC2.7
!CRX_RUN
  Top 0.305: E1.72 88.58,50.16 88.58,53.66 76.2,53.66 40.96,88.9 J4.1 39.37,90.17 IC1.6 IC1.7
!DATA0
  Top 0.305: E1.46 103.82,45.4 112.71,45.4 123.19,55.88 127.32,55.88 128.27,56.83 128.27,59.69 SV183.7 SV183.8
!DATA1  (via drill 0.51)
  Top 0.305: v116.2,44.13 103.82,44.13 E1.44 | SV183.6 SV183.5
  Bottom 0.305: v116.2,44.13 123.19,51.12 123.19,55.88 SV183.6
!DATA2
  Top 0.305: E1.42 103.82,42.86 117.47,42.86 122.56,47.94 122.56,54.61 SV183.4 SV183.3
!DATA3
  Top 0.305: E1.39 103.82,40.96 120.97,40.96 123.19,43.18 123.19,52.07 SV183.2 SV183.1
!DATA4
  Top 0.305: E1.33 103.82,37.15 121.6,37.15 SV182.8 SV182.7
!DATA5
  Top 0.305: E1.32 103.82,36.51 119.7,36.51 SV182.6 SV182.5
!DATA6
  Top 0.305: E1.31 103.82,35.56 104.78,34.61 119.06,34.61 SV182.4 SV182.3
!DATA7
  Top 0.305: E1.29 101.6,33.66 101.6,32.38 102.55,32.38 102.87,32.7 118.43,32.7 SV182.2 SV182.1
!DATA8  (via drill 0.51)
  Top 0.305: v87.63,35.56 87.95,35.56 87.95,33.97 E1.8
  Bottom 0.305: v87.63,35.56 86.68,36.51 84.45,36.51 84.45,36.2 59.69,11.43 14.29,11.43 DR1.1
!DATA9  (via drill 0.51)
  Top 0.305: v26.99,32.38 84.45,32.38 84.45,33.66 E1.3
  Bottom 0.305: v26.99,32.38 19.05,24.45 19.05,19.37 11.11,11.43 DS1.1
!DATA10  (via drill 0.51)
  Top 0.305: v86.36,35.56 87.31,34.61 87.31,33.97 E1.7
  Bottom 0.305: v86.36,35.56 87.31,34.61 88.58,34.61 88.58,35.88 87,37.47 79.38,37.47 79.38,34.92 56.52,12.06 12.38,12.06 12.38,3.49 11.43,2.54 4.76,2.54 DU1.1
!DATA11  (via drill 0.51)
  Top 0.305: v16.83,31.43 85.09,31.43 85.09,33.66 E1.4
  Bottom 0.305: v16.83,31.43 15.56,30.16 1.59,30.16 DV1.1
!DONE_SKIP  (via drill 0.51)
  Top 0.305: v110.49,48.58 94.93,48.58 94.93,49.85 E1.62
  Bottom 0.305: v110.49,48.58 116.52,42.55 116.52,9.53 CB1.1
!INT_RQST  (via drill 0.51)
  Top 0.305: v93.03,29.21 93.03,33.66 E1.16
  Bottom 0.305: v93.03,29.21 87.31,23.5 CP1.1
!INTERNAL_IO  (via drill 0.51)
  Top 0.305: v95.89,32.07 96.2,32.07 96.2,33.66 E1.21
  Bottom 0.305: v95.89,32.07 96.84,31.11 CL1.1
!IO_PAUSE  (via drill 0.51)
  Top 0.305: v113.98,25.72 107.63,32.07 102.87,32.07 102.55,31.75 99.69,31.75 99.69,33.66 E1.26
  Bottom 0.305: v113.98,25.72 115.89,23.81 CD1.1
!MD03
  Top 0.305: 125.09,61.91 125.41,62.23 SV183.9 | 125.09,61.91 109.22,46.04 103.82,46.04 E1.47 | SV183.10 124.78,61.91 125.09,61.91
!MD04
  Top 0.305: 125.09,44.13 125.41,44.45 SV182.15 | 125.09,44.13 121.28,40.32 103.82,40.32 E1.38 | SV182.16 124.78,44.13 125.09,44.13
!MD05
  Top 0.305: E1.37 103.82,39.69 122.24,39.69 SV182.14 SV182.13
!MD06
  Top 0.305: E1.35 103.82,38.42 123.51,38.42 SV182.12 SV182.11 128.27,39.37 128.27,26.35 126.68,24.77 88.27,24.77 82.87,30.16 14.29,30.16 E31.4
!MD07  (via drill 0.51)
  Top 0.305: E1.34 103.82,37.78 123.51,37.78 SV182.10 SV182.9 | E31.5 14.29,27.62 84.77,27.62 90.81,21.59 v117.47,21.59
  Bottom 0.305: v117.47,21.59 123.19,21.59 123.19,35.56 SV182.10
!MD08  (via drill 0.51)
  Top 0.305: v90.17,35.56 90.49,35.56 90.49,33.97 E1.12 | E31.6 9.21,30.16 9.21,10.16 7.62,10.16 6.67,9.21 6.67,5.08 28.89,5.08 DK1.1
  Bottom 0.305: v90.17,35.56 87.63,33.02 81.92,33.02 53.98,5.08 30.16,5.08 DK1.1
!MD09  (via drill 0.51)
  Top 0.305: v90.17,32.07 89.85,32.07 89.85,33.66 E1.11
  Bottom 0.305: v90.17,32.07 89.53,32.07 87.63,30.16 80.33,30.16 52.7,2.54 26.99,2.54 DL1.1
!MD10  (via drill 0.51)
  Top 0.305: v87.63,32.07 89.22,32.07 89.22,33.66 E1.10
  VCC$ 0.305: v87.63,32.07 52.07,32.07 DM1.1
!MD11  (via drill 0.51)
  Top 0.305: v88.9,36.83 88.58,36.83 88.58,33.97 E1.9
  Bottom 0.305: v88.9,36.83 90.49,38.42 90.49,45.4 93.98,48.9 95.25,48.9 95.25,40.01 91.76,36.51 91.76,31.11 82.23,21.59 82.23,3.49 81.28,2.54 70.8,2.54 70.17,3.17 53.98,3.17 52.7,1.91 17.46,1.91 DP1.1
!RX_12_BIT
  Top 0.305: J1.2 IC2.3 32.07,81.6 32.07,89.22 23.5,89.22 13.97,98.74 13.97,127 21.59,127 DRIVE.FF R16.2 R7.1
!RX_DATA
  Top 0.305: J2.2 IC1.3 34.61,94.3 38.73,94.3 39.05,94.61 39.05,97.79 37.78,97.79 31.43,104.14 31.43,133.35 R17.2 | R8.1 R17.2 | R17.2 DRIVE.BB
!RX_DONE  (via drill 0.51)
  Top 0.305: R4.1 R13.2 DRIVE.X | v28.26,77.79 54.93,51.12 78.74,51.12 81.6,48.26 E1.81
  Bottom 0.305: v28.26,77.79 24.77,81.28 24.77,136.53 DRIVE.X
!RX_ERROR  (via drill 0.51)
  Top 0.305: v85.41,51.75 87.31,51.75 87.31,50.16 E1.74 | R5.1 R14.2 DRIVE.J
  Bottom 0.305: v85.41,51.75 39.37,97.79 39.37,147.32 R5.1
!RX_INIT
  Top 0.305: IC2.5 J3.2 | DRIVE.N R9.1
  Bottom 0.305: IC2.5 32.07,83.5 32.07,147 R9.1
!RX_OUT  (via drill 0.51)
  Top 0.305: R3.1 R12.2 DRIVE.RR | v26.99,34.29 82.87,34.29 83.19,33.97 E1.1
  Bottom 0.305: v26.99,34.29 21.59,39.69 21.59,116.84 DRIVE.RR
!RX_RUN
  Top 0.305: IC1.5 J4.2 | R6.1 R15.2 DRIVE.D
  Bottom 0.305: IC1.5 32.7,93.03 32.7,152.4 27.94,157.16 R15.2
!RX_SHIFT  (via drill 0.51)
  Top 0.305: R2.1 R10.2 DRIVE.LL | v37.15,36.51 81.6,36.51 E1.99
  Bottom 0.305: v37.15,36.51 29.21,44.45 29.21,68.26 24.13,73.34 24.13,121.92 DRIVE.LL
!RX_TR_REQ  (via drill 0.51)
  Top 0.305: v28.26,79.06 30.48,79.06 57.78,51.75 83.82,51.75 83.82,50.16 E1.79 | R1.1 R11.2 DRIVE.T
  Bottom 0.305: v28.26,79.06 26.67,80.64 26.67,142.24 R11.2
!SKIP  (via drill 0.51)
  Top 0.305: v86.36,29.21 88.27,31.11 91.76,31.11 91.76,33.66 E1.14
  Bottom 0.305: v86.36,29.21 80.96,23.81 CS1.1
!TR_SKIP  (via drill 0.51)
  Top 0.305: v94.3,47.94 94.3,49.85 E1.63
  Bottom 0.305: v94.3,47.94 91.12,44.77 91.12,34.29 87.95,31.11 80.64,31.11 53.34,3.81 DB1.1
-15V
  Top 0.305: DB2.1 53.66,10.16 120.97,10.16 CB2.1
GND  (via drill 0.51)
  Top 0.305: GND16.1 GND16.2 69.85,173.99 | 69.85,173.99 59.69,173.99 GND15.1 GND15.2 54.61,173.99 31.75,173.99 GND8.1 GND8.2 | 69.85,173.99 85.09,173.99 GND17.2 GND17.1 96.52,167.64 102.87,167.64 | GND24.1 GND24.2 GND23.2 | GND23.1 GND23.2 | GND22.2 ISP.2 102.87,158.75 102.87,167.64 | GND22.2 GND22.1 | GND21.1 GND21.2 ISP.10 102.87,167.64 | GND22.2 GND23.2 | GND1.1 GND1.2 | DRIVE.B DRIVE.A DRIVE.C DRIVE.E | R15.1 R14.1 38.1,151.13 | R12.1 R10.1 R16.1 R17.1 R13.1 R11.1 38.1,151.13 | GND11.1 GND11.2 27.94,113.03 DRIVE.VV DRIVE.UU DRIVE.SS | GND12.1 GND12.2 | DRIVE.E DRIVE.H DRIVE.K | DRIVE.E DRIVE.F | DRIVE.K DRIVE.M DRIVE.P | DRIVE.K DRIVE.L 38.1,151.13 | DRIVE.P DRIVE.S DRIVE.U | DRIVE.P DRIVE.R | DRIVE.U DRIVE.W DRIVE.Y | DRIVE.U DRIVE.V | DRIVE.Y DRIVE.AA DRIVE.CC | DRIVE.Y DRIVE.Z | DRIVE.CC DRIVE.EE | DRIVE.CC DRIVE.DD | DRIVE.JJ DRIVE.HH DRIVE.KK DRIVE.MM | DRIVE.MM DRIVE.PP DRIVE.SS | DRIVE.MM DRIVE.NN | GND4.1 GND4.2 | DRIVE.SS DRIVE.TT | E1.76 86.04,49.85 v86.04,46.04 86.04,44.77 103.5,44.77 E1.45 | 95.57,53.34 95.57,50.16 E1.61 | C2.2 95.57,53.34 | v83.5,43.5 81.92,43.5 E1.88 | 95.57,53.34 93.98,54.93 87.31,54.93 C1.2 | 77.79,6.35 CT2.1 CN2.1 90.49,6.35 | 77.79,6.35 CT1.1 | 90.49,6.35 CN1.1 | 109.54,6.35 CF2.1 CC2.1 CC1.1 | 109.54,6.35 CF1.1 | 91.12,36.51 91.12,37.78 81.92,37.78 E1.97 | 91.12,36.51 91.12,33.97 E1.13 | v100.97,35.56 100.97,33.97 E1.28 | v101.92,41.59 103.5,41.59 E1.40 | GND27.2 GND27.1 | v93.03,36.51 91.12,36.51 | 109.54,6.35 90.49,6.35 | GND13.1 GND13.2 26.67,49.53 7.62,49.53 | GND6.2 GND6.1 7.62,49.53 | C43.- 7.62,49.53 | GND7.1 GND7.2 | DC2.1 49.21,6.35 | 49.21,6.35 DC1.1 DF1.1 DF2.1 27.94,8.89 | GND14.1 GND14.2 27.94,8.89
  Top 0.305: 27.94,8.89 DN2.1 DT2.1 | 49.21,6.35 77.79,6.35
  Bottom 0.305: 17.78,165.1 20.32,162.56 DRIVE.A | 17.78,165.1 GND1.1 | 17.78,165.1 GND8.2 | 31.43,86.68 IC1.4 | 31.43,86.68 31.43,78.42 IC2.4 GND12.1 GND13.1 | GND11.1 31.43,98.11 31.43,86.68 | GND4.1 20.32,111.76 DRIVE.UU | DRIVE.HH DRIVE.EE | v83.5,43.5 v86.04,46.04 86.36,46.35 C1.2 | 101.92,35.56 106.68,35.56 106.68,27.94 109.22,25.4 | 101.92,35.56 v100.97,35.56 | 109.22,25.4 GND27.2 111.76,11.11 CF2.1 | 101.92,35.56 101.92,36.51 | 101.92,36.51 v101.92,41.59 101.92,53.34 C2.2 | 101.92,36.51 v93.03,36.51 | C42.- 109.22,57.15 109.22,25.4 | DT1.1 DT2.1 7.94,22.54 GND7.1 | DN2.1 DN1.1 | GND14.2 GND13.2
  pour GND$: 0,2.54 2.54,0 55.88,0 58.42,2.54 69.85,2.54 72.39,0 125.73,0 129.54,3.81 129.54,177.8 0,177.8
INITIALIZE  (via drill 0.51)
  Top 0.305: v92.08,30.16 92.39,30.16 92.39,33.66 E1.15
  Bottom 0.305: v92.08,30.16 84.14,22.23 CR1.1
N$1
  Top 0.305: E31.3 7.94,39.37 8.89,38.42 15.88,38.42 17.14,39.69 81.6,39.69 E1.94
N$18
  Top 0.305: E31.2 6.67,41.91 6.67,38.73 6.99,38.42 8.26,38.42 8.89,37.78 15.88,37.78 17.14,39.05 81.6,39.05 E1.95
N$19
  Top 0.305: E31.1 6.03,44.45 6.03,38.73 6.99,37.78 8.26,37.78 10.16,35.88 15.88,35.88 18.41,38.42 81.6,38.42 E1.96
N$20
  Top 0.305: E31.14 16.83,40.96 81.6,40.96 E1.92
  Bottom 0.305: E31.11 13.65,33.34 13.65,37.78 E31.14
N$37
  Top 0.305: E31.15 15.56,41.59 81.6,41.59 E1.91
  Bottom 0.305: E31.12 16.19,35.24 16.19,40.96 E31.15
N$38
  Top 0.305: E31.16 16.83,42.86 81.6,42.86 E1.89
  Bottom 0.305: E31.13 14.29,35.88 14.29,33.66 14.61,33.34 16.83,33.34 16.83,42.86 E31.16
N$45
  Top 0.305: SV183.13 SV183.14
N$828
  Top 0.305: SV183.15 SV183.16
PARITY
  Top 0.305: E1.60 96.2,50.16 96.2,52.39 99.38,52.39 111.76,64.77 SV183.12 SV183.11
TCK  (via drill 0.51)
  Top 0.305: v93.66,52.7 93.66,50.16 E1.64
  Bottom 0.305: v93.66,52.7 106.68,65.72 ISP.1
TDI  (via drill 0.51)
  Top 0.305: v107.63,28.26 85.41,28.26 85.41,30.48 86.04,31.11 86.68,31.11 86.68,33.66 E1.6
  Bottom 0.305: v107.63,28.26 108.58,29.21 108.58,165.74 ISP.9
TDO  (via drill 0.51)
  Top 0.305: v87.31,48.26 86.68,48.26 86.68,49.85 E1.75
  Bottom 0.305: v87.31,48.26 90.49,51.44 90.49,142.24 105.41,157.16 105.41,158.75 ISP.3
TMS  (via drill 0.51)
  Top 0.305: v107.63,30.16 93.66,30.16 93.66,33.66 E1.17
  Bottom 0.305: v107.63,30.16 107.95,30.48 107.95,161.29 ISP.5
TP3  (via drill 0.51)
  Top 0.305: v98.42,32.07 97.47,32.07 97.47,33.66 E1.23
  Bottom 0.305: v98.42,32.07 106.05,32.07 106.05,9.21 CH2.1
TP4  (via drill 0.51)
  Top 0.305: v103.19,31.11 96.84,31.11 96.84,33.66 E1.22
  Bottom 0.305: CJ2.1 v103.19,31.11
VCC  (via drill 0.51)
  Top 0.305: VCC17.1 VCC17.2 92.71,176.53 82.55,176.53 VCC16.1 VCC16.2 77.47,176.53 67.31,176.53 VCC15.1 VCC15.2 62.23,176.53 36.83,176.53 | VCC24.1 VCC24.2 VCC23.2 | VCC21.1 VCC21.2 121.92,161.29 | VCC23.1 VCC23.2 | VCC22.1 VCC22.2 | VCC22.2 VCC23.2 | VCC22.2 121.92,161.29 | ISP.4 105.41,161.29 121.92,161.29 | v78.42,35.24 85.41,35.24 85.72,34.92 85.72,33.97 E1.5 | C2.1 91.12,53.34 91.12,50.16 E1.68 | VCC27.2 VCC27.1 125.73,24.13 126.68,24.13 128.91,26.35 128.91,40.64 123.83,40.64 122.24,39.05 103.82,39.05 E1.36 103.5,39.05 98.11,39.05 | 82.87,42.23 82.87,40.64 82.55,40.32 81.92,40.32 E1.93 | 82.87,42.23 81.92,42.23 E1.90 | 84.45,42.23 84.45,44.45 82.87,46.04 81.92,46.04 E1.84 | 82.87,42.23 v83.5,42.23 84.45,42.23 | 95.57,39.05 95.57,33.97 E1.20 | 98.11,39.05 95.57,39.05 | 98.11,39.05 101.6,42.55 102.23,42.55 102.55,42.23 103.5,42.23 E1.41 | 84.45,42.23 87.63,39.05 95.57,39.05 | VCC7.2 VCC7.1 19.05,24.13 36.83,24.13 VCC14.2 VCC14.1 | VCC6.1 VCC6.2 | VCC13.1 VCC13.2 | VCC4.2 VCC4.1 20.64,96.2 37.15,96.2 IC1.8 | VCC11.2 VCC11.1 R3.2 R2.2 R7.2 R8.2 R4.2 R1.2 R9.2 R5.2 R6.2 | VCC12.1 VCC12.2 | VCC1.2 VCC1.1 19.05,176.53 36.83,176.53 | VCC8.1 VCC8.2 36.83,176.53 | v100.01,51.75 100.97,50.8 100.97,50.16 E1.53
  Bottom 0.305: ISP.4 96.52,167.64 VCC17.1 | VCC24.2 111.76,88.9 C42.+ | 91.44,51.75 C2.1 C1.1 | 91.44,51.75 91.44,50.16 v83.5,42.23 78.74,37.47 78.74,35.56 v78.42,35.24 38.1,35.24 | CA2.1 124.46,9.84 VCC27.1 | VCC6.1 VCC7.1 | 38.1,35.24 VCC13.2 VCC12.2 | 38.1,35.24 VCC14.2 | VCC4.2 7.62,91.44 C43.+ | VCC11.2 IC1.8 39.05,94.3 39.05,84.14 | 39.05,84.14 40.64,82.55 VCC12.1 | 39.05,84.14 IC2.8 | R6.2 VCC8.1 | v100.01,51.75 91.44,51.75
  pour VCC$: 0,2.54 2.54,0 55.88,0 58.42,2.54 69.85,2.54 72.39,0 125.73,0 129.54,3.81 129.54,177.8 0,177.8

### Text on the board
tPlace: NC | NC | AB1 | AP1 | AR1 | AS11 | AU1 | AV1 | BK1 | BL1 | BM1 | BP1 | BR1 | BS1 | BU1 | BV1